# Altium project Stream_Deck.PrjPcb
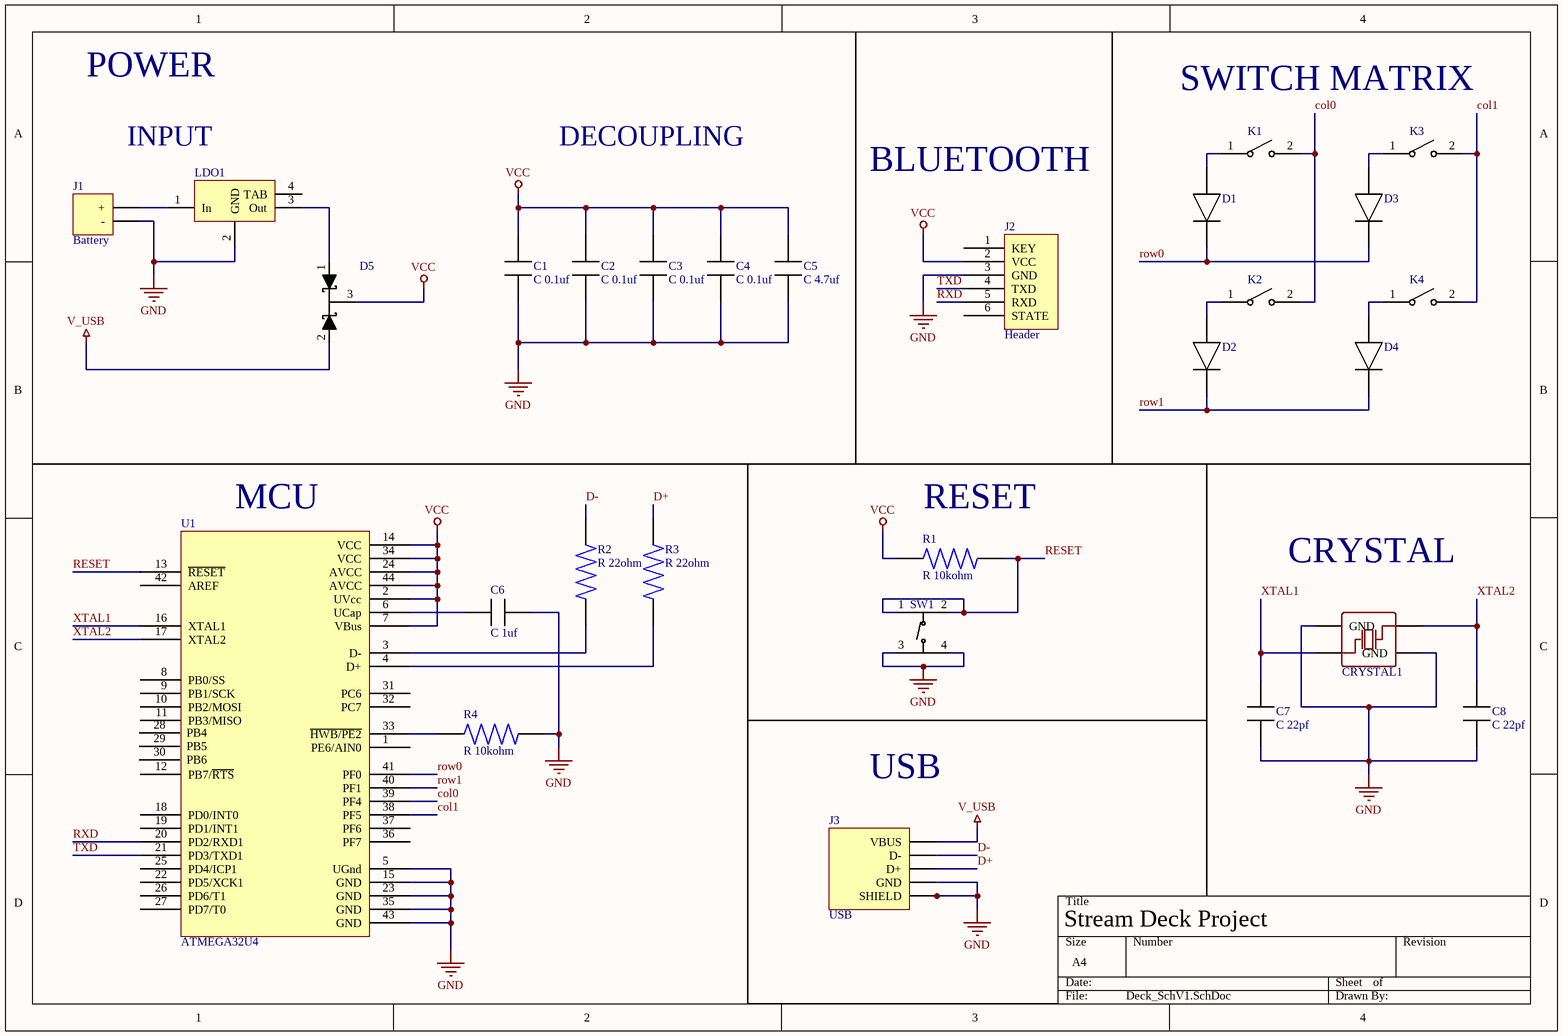
[diagram p0: Deck_SchV1.SchDoc]
1 sheet, 28 parts. Net scope: global (net labels, ports and power ports of the same name join across sheets).
Board file: Deck_PCBV2.PcbDoc

## Sheet Deck_SchV1.SchDoc
size A4; SheetNumber: 1; SheetTotal: 1

### Parts
C1  C 0.1uf  [C0805]
C2  C 0.1uf  [C0805]
C3  C 0.1uf  [C0805]
C4  C 0.1uf  [C0805]
C5  C 4.7uf  [C0805]
C6  C 1uf  [C0805]
C7  C 22pf  [C0805]
C8  C 22pf  [C0805]
CRYSTAL1  Crystal  [CRYSTAL-SMD_4P-L3.2-W2.5-BL]  (value not drawn)
D1  Diode  [Diode]  (value not drawn)
D2  Diode  [Diode]  (value not drawn)
D3  Diode  [Diode]  (value not drawn)
D4  Diode  [Diode]  (value not drawn)
D5  Schottky diode  [SOT95P237X111-3N]  (value not drawn)
J1  Battery  [HDR-TH_2P-P2.54-V-M-1]
J2  Header  [HDR-TH_6P-P2.54-H-W8.6_A2541HWR-6P]
J3  USB  [USB]
K1  Switch  [Mx_Alps_100]  (value not drawn)
K2  Switch  [Mx_Alps_100]  (value not drawn)
K3  Switch  [Mx_Alps_100]  (value not drawn)
K4  Switch  [Mx_Alps_100]  (value not drawn)
LDO1  5V regulator  [SOT-223_L6.5-W3.5-P2.30-LS7.0-BR]  (value not drawn)
R1  R 10kohm  [R0805]
R2  R 22ohm  [R0805]
R3  R 22ohm  [R0805]
R4  R 10kohm  [R0805]
SW1  Button  [SW-SMD_4P-L5.1-W5.1-P3.70-LS6.5-TL-2]  (value not drawn)
U1  ATMEGA32U4  [ATMEGA32U2-AUR]

### Nets
GND: C1.1 C2.1 C3.1 C4.1 C5.1 C6.1 C7.1 C8.1 CRYSTAL1.2(GND) CRYSTAL1.4(GND) J1.2(-) J2.3(GND) J3.4(GND) J3.5(SHIELD) J3.S1 J3.S2 J3.S3 J3.S4 LDO1.2(GND) R4.2 SW1.3(C) SW1.4(D) U1.5(UGnd) U1.15(GND) U1.23(GND) U1.35(GND) U1.43(GND)
V_USB: D5.2 J3.1(VBUS)
VCC: C1.2 C2.2 C3.2 C4.2 C5.2 D5.3 J2.2(VCC) R1.1 U1.2(UVcc) U1.7(VBus) U1.14(VCC) U1.24(AVCC) U1.34(VCC) U1.44(AVCC)
col0: K1.2 K2.2 U1.39(PF4)
col1: K3.2 K4.2 U1.38(PF5)
D+: J3.3(D+) R3.2
D-: J3.2(D-) R2.2
RESET: R1.2 SW1.1(A) SW1.2(B) U1.13(~{RESET})
row0: D1.2(-) D3.2(-) U1.41(PF0)
row1: D2.2(-) D4.2(-) U1.40(PF1)
RXD: J2.5(RXD) U1.20(PD2/RXD1)
TXD: J2.4(TXD) U1.21(PD3/TXD1)
XTAL1: C7.2 CRYSTAL1.1(OSC1) U1.16(XTAL1)
XTAL2: C8.2 CRYSTAL1.3(OSC2) U1.17(XTAL2)
NetC6_2: C6.2 U1.6(UCap)
NetD1_1: D1.1(+) K1.1
NetD2_1: D2.1(+) K2.1
NetD3_1: D3.1(+) K3.1
NetD4_1: D4.1(+) K4.1
NetD5_1: D5.1 LDO1.3(Out)
NetJ1_1: J1.1(+) LDO1.1(In)
NetR2_1: R2.1 U1.3(D-)
NetR3_1: R3.1 U1.4(D+)
NetR4_1: R4.1 U1.33(~{HWB/PE2})

Not connected (* = marked no-connect by the designer): J2 1(KEY) 6(STATE); LDO1 4(TAB); U1 1(PE6/AIN0) 8(PB0/SS) 9(PB1/SCK) 10(PB2/MOSI) 11(PB3/MISO) 12(PB7/~{RTS}) 18(PD0/INT0) 19(PD1/INT1) 22(PD5/XCK1) 25(PD4/ICP1) 26(PD6/T1) 27(PD7/T0) 28(PB4) 29(PB5) 30(PB6) 31(PC6) 32(PC7) 36(PF7) 37(PF6) 42(AREF)

### Notes on the sheet
- POWER
- SWITCH MATRIX
- INPUT
- DECOUPLING
- BLUETOOTH
- (near U1) MCU
- (near R1) RESET
- CRYSTAL
- USB
- Stream Deck Project

### Library data of the parts
C1-C4 = CC0805ZRY5V9BB104: YAGEO (PHYCOMP)         CC0805ZRY5V9BB104             SMD Multilayer Ceramic Capacitor, 0805 [2012 Metric], 0.1 F, 50 V, +80%, -20%, Y5V, CC Series; Capacitance: 100nF; Tolerance: 80%; Voltage Rating: 50V; Supplier 1: Digi-Key; Manufacturer: Yageo; Manufacturer Part Number: CC0805ZRY5V9BB104; RoHS: Yes; Category: Ceramic Capacitors; Stock 1: 165123; Pricing 1: 1=0.10000, 10=0.07000, 50=0.03800, 100=0.03100, 500=0.02214, 1000=0.01739 (USD); Mount: Surface Mount; Case/Package: 0805; Number of Pins: 2; Case Code (Metric): 2012; Case Code (Imperial): 0805; Material: Ceramic; Dielectric Material: Ceramic; Min Operating Temperature: -30°C; Max Operating Temperature: 85°C; Dielectric: Y5V; Package Quantity: 1; Packaging: Tape and Reel; Voltage Rating (DC): 50V; Termination: SMD/SMT; Resistor Type: Ceramic; Series: CC; Construction: Flat; Length: 2mm; Width: 0.049inch; Height: 0.6mm; Depth: 1.25mm; Thickness: 0.024inch; Radiation Hardening: No; REACH SVHC: No SVHC; Lead Free: Lead Free; Halogen Free: Halogen Free; RoHS Compliant: Yes; ComponentLink1URL: https://datasheet.ciiva.com/144/mlccorderingcode-144209.pdf?src-supplier=Digi-Key; ComponentLink1Description: https://datasheet.ciiva.com/144/mlccorderingcode-144209.pdf?src-supplier=Digi-Key; ComponentLink2URL: https://datasheet.ciiva.com/144/mlccorderingcode-144210.pdf?src-supplier=Digi-Key; ComponentLink2Description: https://datasheet.ciiva.com/144/mlccorderingcode-144210.pdf?src-supplier=Digi-Key; ComponentLink3URL: https://datasheet.ciiva.com/144/mlccorderingcode-144211.pdf?src-supplier=Digi-Key; ComponentLink3Description: https://datasheet.ciiva.com/144/mlccorderingcode-144211.pdf?src-supplier=Digi-Key; ComponentLink4URL: https://datasheet.ciiva.com/15189/getdatasheetpartid-55882-15189238.pdf?src-supplier=Verical; ComponentLink4Description: https://datasheet.ciiva.com/15189/getdatasheetpartid-55882-15189238.pdf?src-supplier=Verical; ComponentLink5URL: https://datasheet.ciiva.com/28450/1132289-28450870.pdf?src-supplier=Element14; ComponentLink5Description: https://datasheet.ciiva.com/28450/1132289-28450870.pdf?src-supplier=Element14; ComponentLink6URL: https://datasheet.ciiva.com/13389/upy-gp-np0-16v-to-50v-8-13389351.pdf?src-supplier=Mouser; ComponentLink6Description: https://datasheet.ciiva.com/13389/upy-gp-np0-16v-to-50v-8-13389351.pdf?src-supplier=Mouser; ComponentLink7URL: https://datasheet.ciiva.com/11465/upy-gphc-y5v-6-3v-to-50v-5-11465865.pdf?src-supplier=Avnet; ComponentLink7Description: https://datasheet.ciiva.com/11465/upy-gphc-y5v-6-3v-to-50v-5-11465865.pdf?src-supplier=Avnet; ComponentLink8URL: https://datasheet.ciiva.com/16747/upy-gphc-y5v-6-3v-to-50v-5-revised-16747323.pdf?src-supplier=Future+Electronics; ComponentLink8Description: https://datasheet.ciiva.com/16747/upy-gphc-y5v-6-3v-to-50v-5-revised-16747323.pdf?src-supplier=Future+Electronics; ComponentLink9URL: https://datasheet.ciiva.com/17435/upy-gphc-y5v-6-3v-to-50v-5-17435053.pdf?src-supplier=Avnet+Europe; ComponentLink9Description: https://datasheet.ciiva.com/17435/upy-gphc-y5v-6-3v-to-50v-5-17435053.pdf?src-supplier=Avnet+Europe; ComponentLink10URL: https://datasheet.ciiva.com/29241/445331-da-01-en-kerko-chip-0805-y5v0-1uf-20-80proz50vg-29241946.pdf?src-supplier=Conrad; ComponentLink10Description: https://datasheet.ciiva.com/29241/445331-da-01-en-kerko-chip-0805-y5v0-1uf-20-80proz50vg-29241946.pdf?src-supplier=Conrad; Supplier Part Number 1: 311-1361-1-ND
C5 = CL21A475KAQNNNE: SAMSUNG ELECTRO-MECHANICS - CL21A475KAQNNNE - SMD Multilayer Ceramic Capacitor, 4.7 µF, 25 V, 0805 [2012 Metric], ± 10%, X5R, CL Series; Voltage Rating: 25V; Supplier 1: Digi-Key; Manufacturer: Samsung; Manufacturer Part Number: CL21A475KAQNNNE; RoHS: Yes; Category: Ceramic Capacitors; Pricing 1: 1=0.12000, 10=0.08300, 50=0.04700, 100=0.03890, 500=0.02728, 1000=0.02259 (USD); Mount: Surface Mount; Case/Package: 0805; Case Code (Metric): 2012; Case Code (Imperial): 0805; Min Operating Temperature: -55°C; Max Operating Temperature: 85°C; Package Quantity: 1; Packaging: Tape and Reel; Capacitance: 4.7uF; Tolerance: 10%; Dielectric: X5R; Voltage Rating (DC): 25V; Series: CL; Construction: Flat; Length: 2mm; Width: 0.049inch; Height: 1.25mm; Thickness: 0.055inch; Depth: 1.25mm; Radiation Hardening: No; Lead Free: Lead Free; RoHS Compliant: Yes; ComponentLink1URL: https://datasheet.ciiva.com/25798/cl21a475kaqnnne-25798882.pdf?src-supplier=Digi-Key; ComponentLink1Description: https://datasheet.ciiva.com/25798/cl21a475kaqnnne-25798882.pdf?src-supplier=Digi-Key; Supplier Part Number 1: 1276-1244-1-ND
C6 = CL21B105KBFNNNE: SAMSUNG ELECTRO-MECHANICS - CL21B105KBFNNNE - SMD Multilayer Ceramic Capacitor, 1 µF, 50 V, 0805 [2012 Metric], ± 10%, X7R, CL Series; Voltage Rating: 50V; Supplier 1: Digi-Key; Manufacturer: Samsung; Manufacturer Part Number: CL21B105KBFNNNE; RoHS: Yes; Category: Ceramic Capacitors; Pricing 1: 1=0.13000, 10=0.09000, 50=0.05120, 100=0.04250, 500=0.02978, 1000=0.02465 (USD); Mount: Surface Mount; Case/Package: 0805; Case Code (Metric): 2012; Case Code (Imperial): 0805; Min Operating Temperature: -55°C; Max Operating Temperature: 125°C; Tolerance: 10%; Packaging: Tape and Reel; Package Quantity: 1; Capacitance: 1uF; Dielectric: X7R; Voltage: 50V; Series: CL; Construction: Flat; Length: 2mm; Width: 0.049inch; Height: 1.25mm; Thickness: 0.053inch; Depth: 1.25mm; Radiation Hardening: No; RoHS Compliant: Yes; ComponentLink1URL: https://datasheet.ciiva.com/25800/cl21b105kbfnnne-25800291.pdf?src-supplier=Digi-Key; ComponentLink1Description: https://datasheet.ciiva.com/25800/cl21b105kbfnnne-25800291.pdf?src-supplier=Digi-Key; ComponentLink2URL: https://datasheet.ciiva.com/16449/cl21b105kbfnnne-16449003.pdf?src-supplier=Future+Electronics; ComponentLink2Description: https://datasheet.ciiva.com/16449/cl21b105kbfnnne-16449003.pdf?src-supplier=Future+Electronics; ComponentLink3URL: https://datasheet.ciiva.com/26838/getdatasheetpartid-354075-26838668.pdf?src-supplier=Verical; ComponentLink3Description: https://datasheet.ciiva.com/26838/getdatasheetpartid-354075-26838668.pdf?src-supplier=Verical; Supplier Part Number 1: 1276-1029-1-ND
C7 C8 = CL21C220JBANNNC: Cap Ceramic 22pF 50V C0G 5% SMD 0805 125C T/R; Manufacturer: Samsung; Temperature Coefficient: 300ppm/°C; Supplier 1: Digi-Key; Manufacturer Part Number: CL21C220JBANNNC; RoHS: Yes; Category: Ceramic Capacitors; Stock 1: 3782; Pricing 1: 1=0.10000, 10=0.05400, 50=0.02940, 100=0.02390, 500=0.01710, 1000=0.01344 (USD); Mount: Surface Mount; Case/Package: 0805; Case Code (Metric): 2012; Case Code (Imperial): 0805; Contact Plating: Tin; Material: Ceramic; Min Operating Temperature: -55°C; Max Operating Temperature: 125°C; Tolerance: 5%; Capacitance: 22pF; Dielectric: C0G; Voltage Rating (DC): 50V; Packaging: Tape and Reel; Package Quantity: 1; Voltage Rating: 50V; Voltage: 50V; Length: 2mm; Width: 0.049inch; Height: 0.65mm; Depth: 1.25mm; Thickness: 0.03inch; Radiation Hardening: No; Lead Free: Lead Free; ComponentLink1URL: https://datasheet.ciiva.com/25801/cl21c220jbannnc-25801668.pdf?src-supplier=Digi-Key; ComponentLink1Description: https://datasheet.ciiva.com/25801/cl21c220jbannnc-25801668.pdf?src-supplier=Digi-Key; ComponentLink2URL: https://datasheet.ciiva.com/15227/getdatasheetpartid-355345-15227198.pdf?src-supplier=Verical; ComponentLink2Description: https://datasheet.ciiva.com/15227/getdatasheetpartid-355345-15227198.pdf?src-supplier=Verical; ComponentLink3URL: https://datasheet.ciiva.com/29199/454687-da-01-en-vs-kondensator-0805-29199501.pdf?src-supplier=Conrad; ComponentLink3Description: https://datasheet.ciiva.com/29199/454687-da-01-en-vs-kondensator-0805-29199501.pdf?src-supplier=Conrad; ComponentLink4URL: https://datasheet.ciiva.com/16387/cl05b104kq5nnnc-16387287.pdf?src-supplier=Future+Electronics; ComponentLink4Description: https://datasheet.ciiva.com/16387/cl05b104kq5nnnc-16387287.pdf?src-supplier=Future+Electronics; Supplier Part Number 1: 1276-1047-1-ND
CRYSTAL1 = X1E0000210264: Manufacturer: Seiko; Supplier 1: LCSC; Manufacturer Part Number: X1E0000210264; RoHS: No; Stock 1: 1224; Pricing 1: 1=2.09620, 10=1.67710, 30=1.60010, 100=1.52310, 500=1.48900, 1000=1.47200, 1=2.02540, 10=1.62050, 30=1.54610, 100=1.47170, 500=1.43870, 1000=1.42230, 1=10.59440, 10=8.47640, 30=8.08720, 100=7.69800, 500=7.52550, 1000=7.43980, 1=10.05890, 10=8.04800, 30=7.67840, 100=7.30890, 500=7.14500, 1000=7.06370, 1=1.35280, 10=1.08240, 30=1.03270, 100=0.98300, 500=0.96090, 1000=0.95000, 1=1.17590, 10=0.94090, 30=0.89760, 100=0.85440, 500=0.83530, 1000=0.82580, 1=12.67600, 10=10.14190, 30=9.67620, 100=9.21050, 500=9.00410, 1000=8.90160, 1=176.85110, 10=141.49600, 30=134.99890, 100=128.50180, 500=125.62140, 1000=124.19210, 1=6.69450, 10=5.35620, 30=5.11020, 100=4.86430, 500=4.75520, 1000=4.70110, 1=122.46140, 10=97.97960, 30=93.48070, 100=88.98170, 500=86.98720, 1000=85.99740, 1=13.69750, 10=10.95920, 30=10.45600, 100=9.95270, 500=9.72970, 1000=9.61890, 1=2.16650, 10=1.73340, 30=1.65380, 100=1.57420, 500=1.53890, 1000=1.52140, 1=1.63320, 10=1.30670, 30=1.24670, 100=1.18670, 500=1.16010, 1000=1.14690 (AUD); Supplier Part Number 1: C91744
D1-D4 = 1N4148W-TP: MICRO COMMERCIAL COMPONENTS - 1N4148W-TP - SWITCHING DIODE, 150mA, 100V, SOD123, FU; Manufacturer: MCC; Max Surge Current: 2A; Forward Voltage: 1V; Recovery Time: 4ns; Max Reverse Leakage Current: 5uA; Power Dissipation: 400mW; Max Forward Surge Current (Ifsm): 1A; Element Configuration: Single; Polarity: Standard; Capacitance: 4pF; Supplier 1: Digi-Key; Manufacturer Part Number: 1N4148W-TP; RoHS: Yes; Category: Rectifier Diodes; Stock 1: 2236013; Pricing 1: 1=0.19000, 10=0.17300, 100=0.09440, 500=0.05808, 1000=0.03960 (USD); Mount: Surface Mount; Number of Pins: 2; Min Operating Temperature: -65°C; Max Operating Temperature: 150°C; Packaging: Tape and Reel; Forward Current: 150mA; Package Quantity: 3000; Average Rectified Current: 150mA; Reverse Recovery Time: 4ns; Max Repetitive Reverse Voltage (Vrrm): 100V; Peak Non-Repetitive Surge Current: 2A; Voltage Rating (DC): 100V; Current Rating: 150mA; Output Current: 150mA; Max Reverse Voltage (DC): 100V; Length: 2.85mm; Width: 1.8mm; Height: 1.2mm; Radiation Hardening: No; REACH SVHC: Unknown; Lead Free: Lead Free; ComponentLink1URL: https://datasheet.ciiva.com/1243/1684829-1243908.pdf?src-supplier=Newark; ComponentLink1Description: https://datasheet.ciiva.com/1243/1684829-1243908.pdf?src-supplier=Newark; ComponentLink2URL: https://datasheet.ciiva.com/16836/1n4148wsod123-16836277.pdf?src-supplier=Future+Electronics; ComponentLink2Description: https://datasheet.ciiva.com/16836/1n4148wsod123-16836277.pdf?src-supplier=Future+Electronics; ComponentLink3URL: https://datasheet.ciiva.com/4435/1n4148wsod123-48460-4435223.pdf?src-supplier=Mouser; ComponentLink3Description: https://datasheet.ciiva.com/4435/1n4148wsod123-48460-4435223.pdf?src-supplier=Mouser; ComponentLink4URL: https://datasheet.ciiva.com/14557/70055519-14557767.pdf?src-supplier=Allied+Electronics; ComponentLink4Description: https://datasheet.ciiva.com/14557/70055519-14557767.pdf?src-supplier=Allied+Electronics; ComponentLink5URL: https://datasheet.ciiva.com/911/1n4148wsod123-911676.pdf?src-supplier=Digi-Key; ComponentLink5Description: https://datasheet.ciiva.com/911/1n4148wsod123-911676.pdf?src-supplier=Digi-Key; ComponentLink6URL: https://datasheet.ciiva.com/7622/1684829-7622556.pdf?src-supplier=Element14; ComponentLink6Description: https://datasheet.ciiva.com/7622/1684829-7622556.pdf?src-supplier=Element14; ComponentLink7URL: https://datasheet.ciiva.com/911/1n4148wsod123-911677.pdf?src-supplier=Digi-Key; ComponentLink7Description: https://datasheet.ciiva.com/911/1n4148wsod123-911677.pdf?src-supplier=Digi-Key; ComponentLink8URL: https://datasheet.ciiva.com/911/1n4148wsod123-911678.pdf?src-supplier=Digi-Key; ComponentLink8Description: https://datasheet.ciiva.com/911/1n4148wsod123-911678.pdf?src-supplier=Digi-Key; ComponentLink9URL: https://datasheet.ciiva.com/22747/1684829-22747439.pdf?src-supplier=Element14; ComponentLink9Description: https://datasheet.ciiva.com/22747/1684829-22747439.pdf?src-supplier=Element14; Supplier Part Number 1: 1N4148WTPMSCT-ND
D5 = BAT54CLT1G: Diode Schottky 30V 0.2A 3-Pin SOT-23 T/R; Manufacturer: ON Semiconductor; Forward Current: 200mA; Element Configuration: Common Cathode; Max Power Dissipation: 225mW; Recovery Time: 5ns; Max Reverse Leakage Current: 2uA; Peak Non-Repetitive Surge Current: 600mA; Capacitance: 10pF; Forward Voltage: 800mV; Supplier 1: Digi-Key; Manufacturer Part Number: BAT54CLT1G; RoHS: Yes; Category: Schottky Diodes; Pricing 1: 1=0.17000, 10=0.15600, 100=0.08490, 500=0.05224, 1000=0.03562 (USD); Case/Package: SOT-23-3; Number of Pins: 3; Contact Plating: Tin,Matte; Min Operating Temperature: -55°C; Max Operating Temperature: 125°C; Packaging: Tape and Reel; Package Quantity: 3000; Average Rectified Current: 200mA; Reverse Recovery Time: 5ns; Max Repetitive Reverse Voltage (Vrrm): 30V; Max Forward Surge Current (Ifsm): 600mA; Current Rating: 200mA; Voltage Rating (DC): 30V; Max Reverse Voltage (DC): 30V; Max Surge Current: 600mA; Max Reverse Current: 2uA; Power Dissipation: 225mW; Length: 3.04mm; Width: 1.4mm; Height: 1.01mm; Radiation Hardening: No; Lead Free: Lead Free; Halogen Free: Halogen Free; REACH SVHC: No SVHC; ComponentLink1URL: https://datasheet.ciiva.com/1240/bat54clt1-d-1240707.pdf?src-supplier=Newark; ComponentLink1Description: https://datasheet.ciiva.com/1240/bat54clt1-d-1240707.pdf?src-supplier=Newark; ComponentLink2URL: https://datasheet.ciiva.com/30479/0900766b8121b932-30479128.pdf?src-supplier=RSComponents; ComponentLink2Description: https://datasheet.ciiva.com/30479/0900766b8121b932-30479128.pdf?src-supplier=RSComponents; ComponentLink3URL: https://datasheet.ciiva.com/34301/885769-34301654.pdf?src-supplier=Jameco; ComponentLink3Description: https://datasheet.ciiva.com/34301/885769-34301654.pdf?src-supplier=Jameco; ComponentLink4URL: https://datasheet.ciiva.com/15144/getdatasheetpartid-98336-15144809.pdf?src-supplier=Verical; ComponentLink4Description: https://datasheet.ciiva.com/15144/getdatasheetpartid-98336-15144809.pdf?src-supplier=Verical; ComponentLink5URL: https://datasheet.ciiva.com/1180/bat54clt1-d-1180248.pdf?src-supplier=Element14; ComponentLink5Description: https://datasheet.ciiva.com/1180/bat54clt1-d-1180248.pdf?src-supplier=Element14; ComponentLink6URL: https://datasheet.ciiva.com/1180/bat54clt1-d-1180247.pdf?src-supplier=Element14; ComponentLink6Description: https://datasheet.ciiva.com/1180/bat54clt1-d-1180247.pdf?src-supplier=Element14; ComponentLink7URL: https://datasheet.ciiva.com/22659/1918740-22659014.pdf?src-supplier=Element14; ComponentLink7Description: https://datasheet.ciiva.com/22659/1918740-22659014.pdf?src-supplier=Element14; ComponentLink8URL: https://datasheet.ciiva.com/28655/bat54clt1-d-28655787.pdf?src-supplier=Element14; ComponentLink8Description: https://datasheet.ciiva.com/28655/bat54clt1-d-28655787.pdf?src-supplier=Element14; ComponentLink9URL: https://datasheet.ciiva.com/8294/bat54clt1-d-8294495.pdf?src-supplier=Avnet; ComponentLink9Description: https://datasheet.ciiva.com/8294/bat54clt1-d-8294495.pdf?src-supplier=Avnet; ComponentLink10URL: https://datasheet.ciiva.com/16205/bat54clt1-d-16205033.pdf?src-supplier=Future+Electronics; ComponentLink10Description: https://datasheet.ciiva.com/16205/bat54clt1-d-16205033.pdf?src-supplier=Future+Electronics; ComponentLink11URL: https://datasheet.ciiva.com/905/bat54clt1-d-905835.pdf?src-supplier=Digi-Key; ComponentLink11Description: https://datasheet.ciiva.com/905/bat54clt1-d-905835.pdf?src-supplier=Digi-Key; Supplier Part Number 1: BAT54CLT1GOSCT-ND
J1 = 22-28-4020: CONN HEADER VERT 2POS 2.54MM; Manufacturer: Molex; Number of Contacts: 2; Current Rating: 4A; Voltage Rating: 250V; Gender: Male; Contact Resistance: 20mR; Connector Type: Male Pin; Glow Wire Compliant: Non-compliant; Supplier 1: Digi-Key; Manufacturer Part Number: 22-28-4020; RoHS: Yes; Category: Headers and Wire Housings; Stock 1: 3528; Pricing 1: 1=0.12000, 10=0.08200, 100=0.05890 (USD); Mount: Through Hole; Contact Plating: Tin; Contact Material: Brass,Bronze; Housing Material: Nylon; Color: Black; Housing Color: Black; Min Operating Temperature: 0°C; Max Operating Temperature: 75°C; Number of Rows: 1; Termination: Solder; Orientation: Straight; Package Quantity: 1; Packaging: Bulk; Max Voltage Rating (DC): 250V; Number of Positions: 2; Voltage Rating (DC): 250V; Number of Circuits: 2; Series: KK® 42375; Contact Type: Male Pin; Max Voltage Rating (AC): 250V; Pitch: 2.54mm; Contact Mating Length: 0.24inch; Depth: 2.49mm; Radiation Hardening: No; REACH SVHC: Unknown; Lead Free: Lead Free; Flammability Rating: UL94 V-0; ComponentLink1URL: https://datasheet.ciiva.com/1433/1596842-1433683.pdf?src-supplier=Element14; ComponentLink1Description: https://datasheet.ciiva.com/1433/1596842-1433683.pdf?src-supplier=Element14; ComponentLink2URL: https://datasheet.ciiva.com/30153/214440022284020-pcb-headers-30153261.pdf?src-supplier=Onlinecomponents.com; ComponentLink2Description: https://datasheet.ciiva.com/30153/214440022284020-pcb-headers-30153261.pdf?src-supplier=Onlinecomponents.com; ComponentLink3URL: https://datasheet.ciiva.com/16658/0022284020-pcb-headers-16658182.pdf?src-supplier=Avnet+Europe; ComponentLink3Description: https://datasheet.ciiva.com/16658/0022284020-pcb-headers-16658182.pdf?src-supplier=Avnet+Europe; ComponentLink4URL: https://datasheet.ciiva.com/5157/0022284020-pcb-headers-228358-5157523.pdf?src-supplier=Mouser; ComponentLink4Description: https://datasheet.ciiva.com/5157/0022284020-pcb-headers-228358-5157523.pdf?src-supplier=Mouser; ComponentLink5URL: https://datasheet.ciiva.com/15217/getdatasheetpartid-127875-15217702.pdf?src-supplier=Verical; ComponentLink5Description: https://datasheet.ciiva.com/15217/getdatasheetpartid-127875-15217702.pdf?src-supplier=Verical; ComponentLink6URL: https://datasheet.ciiva.com/10088/0022284020-pcb-headers-10088332.pdf?src-supplier=Avnet; ComponentLink6Description: https://datasheet.ciiva.com/10088/0022284020-pcb-headers-10088332.pdf?src-supplier=Avnet; ComponentLink7URL: https://datasheet.ciiva.com/49385/879406-49385687.pdf?src-supplier=Jameco; ComponentLink7Description: https://datasheet.ciiva.com/49385/879406-49385687.pdf?src-supplier=Jameco; Supplier Part Number 1: WM50014-02-ND
J2 = A2541HWR-6P: Manufacturer: CJT Connectors; Supplier 1: LCSC; Manufacturer Part Number: A2541HWR-6P; Stock 1: 3270; Pricing 1: 1=1.41510, 10=1.13220, 30=1.08030, 100=1.02830, 500=1.00520, 1000=0.99380, 1=1.36720, 10=1.09390, 30=1.04380, 100=0.99360, 500=0.97130, 1000=0.96020, 1=7.15180, 10=5.72210, 30=5.46000, 100=5.19730, 500=5.08050, 1000=5.02280, 1=6.79030, 10=5.43280, 30=5.18400, 100=4.93460, 500=4.82370, 1000=4.76890, 1=0.91320, 10=0.73070, 30=0.69720, 100=0.66370, 500=0.64870, 1000=0.64140, 1=0.79380, 10=0.63510, 30=0.60600, 100=0.57690, 500=0.56390, 1000=0.55750, 1=8.55700, 10=6.84640, 30=6.53280, 100=6.21850, 500=6.07880, 1000=6.00970, 1=119.38420, 10=95.51820, 30=91.14350, 100=86.75790, 500=84.80880, 1000=83.84510, 1=4.51910, 10=3.61570, 30=3.45010, 100=3.28410, 500=3.21030, 1000=3.17390, 1=82.66820, 10=66.14210, 30=63.11280, 100=60.07600, 500=58.72630, 1000=58.05890, 1=9.24660, 10=7.39810, 30=7.05930, 100=6.71960, 500=6.56860, 1000=6.49400, 1=1.46250, 10=1.17010, 30=1.11650, 100=1.06280, 500=1.03890, 1000=1.02710, 1=1.10250, 10=0.88210, 30=0.84170, 100=0.80120, 500=0.78320, 1000=0.77430 (AUD); Supplier Part Number 1: C225514
J3 = UX60SC-MB-5S8: Conn Mini USB 2.0 Type B RCP 5 POS 0.8mm Solder RA SMD 5 Terminal 1 Port Embossed T/R; Manufacturer: Hirose; Number of Terminals/Pins: 5; Gender: Receptacle; Connector Type: USB,Receptacle; Current Rating: 1A; Number of Ports: 1; Insulation Resistance: 100MR; Max Voltage Rating (AC): 5V; USB Standard: USB 2.0; Supplier 1: Digi-Key; Manufacturer Part Number: UX60SC-MB-5S8; RoHS: Yes; Category: USB Connectors; Stock 1: 1825; Pricing 1: 1=0.99000, 10=0.86700, 25=0.81600, 50=0.78200, 100=0.74800, 250=0.68000, 500=0.61200 (USD); Mount: Surface Mount,Horizontal,Through Hole; Contact Material: Copper Alloy,Copper; Contact Plating: Gold; Min Operating Temperature: -30°C; Max Operating Temperature: 75°C; Package Quantity: 1000; Packaging: Tape and Reel; Number of Contacts: 5; Termination: Solder; Orientation: Right Angle; Series: UX60S; Number of Rows: 1; Max Current Rating: 1A; Number of Positions: 5; Length: 7.7mm; Pitch: 0.8mm; Depth: 7mm; REACH SVHC: No SVHC; Lead Free: Lead Free; ComponentLink1URL: https://datasheet.ciiva.com/22666/1693469-22666928.pdf?src-supplier=Element14; ComponentLink1Description: https://datasheet.ciiva.com/22666/1693469-22666928.pdf?src-supplier=Element14; ComponentLink2URL: https://datasheet.ciiva.com/15181/getdatasheetpartid-457316-15181367.pdf?src-supplier=Verical; ComponentLink2Description: https://datasheet.ciiva.com/15181/getdatasheetpartid-457316-15181367.pdf?src-supplier=Verical; ComponentLink3URL: https://datasheet.ciiva.com/4598/ed-ux-20140717-4598805.pdf?src-supplier=Mouser; ComponentLink3Description: https://datasheet.ciiva.com/4598/ed-ux-20140717-4598805.pdf?src-supplier=Mouser; Supplier Part Number 1: H11589CT-ND
K1-K4 = Keyboard Switch
LDO1 = AMS1117-5.0: Manufacturer: Advanced Monolithic Systems; Supplier 1: LCSC; Manufacturer Part Number: AMS1117-5.0; RoHS: Yes; Stock 1: 41515; Pricing 1: 1=1.19980, 10=0.91640, 30=0.86440, 100=0.81230, 500=0.78920, 1000=0.77780, 1=1.15930, 10=0.88550, 30=0.83520, 100=0.78490, 500=0.76260, 1000=0.75150, 1=6.06400, 10=4.63160, 30=4.36890, 100=4.10560, 500=3.98880, 1000=3.93110, 1=5.75740, 10=4.39750, 30=4.14810, 100=3.89800, 500=3.78720, 1000=3.73230, 1=0.77430, 10=0.59140, 30=0.55790, 100=0.52430, 500=0.50930, 1000=0.50200, 1=0.67310, 10=0.51410, 30=0.48490, 100=0.45570, 500=0.44270, 1000=0.43630, 1=7.25540, 10=5.54170, 30=5.22730, 100=4.91220, 500=4.77250, 1000=4.70340, 1=101.22480, 10=77.31550, 30=72.92990, 100=68.53360, 500=66.58440, 1000=65.62070, 1=3.83170, 10=2.92670, 30=2.76070, 100=2.59430, 500=2.52050, 1000=2.48400, 1=70.09360, 10=53.53750, 30=50.50070, 100=47.45640, 500=46.10670, 1000=45.43940, 1=7.84010, 10=5.98830, 30=5.64860, 100=5.30810, 500=5.15710, 1000=5.08250, 1=1.24000, 10=0.94710, 30=0.89340, 100=0.83960, 500=0.81570, 1000=0.80390, 1=0.93480, 10=0.71400, 30=0.67350, 100=0.63290, 500=0.61490, 1000=0.60600 (AUD); Case/Package: Module; Supplier Part Number 1: C6187
R1 R4 = 0805W8F1002T5E: Manufacturer: Uniroyal; Supplier 1: LCSC; Manufacturer Part Number: 0805W8F1002T5E; RoHS: Yes; Stock 1: 3620200; Pricing 1: 100=0.01880, 1000=0.01500, 3000=0.01410, 10000=0.01280, 50000=0.01230, 100000=0.01220, 100=0.01820, 1000=0.01450, 3000=0.01360, 10000=0.01240, 50000=0.01190, 100000=0.01180, 100=0.09500, 1000=0.07590, 3000=0.07110, 10000=0.06490, 50000=0.06200, 100000=0.06150, 100=0.09020, 1000=0.07200, 3000=0.06750, 10000=0.06160, 50000=0.05890, 100000=0.05840, 100=0.01210, 1000=0.00970, 3000=0.00910, 10000=0.00830, 50000=0.00790, 100000=0.00790, 100=0.01050, 1000=0.00840, 3000=0.00790, 10000=0.00720, 50000=0.00690, 100000=0.00680, 100=0.11370, 1000=0.09080, 3000=0.08500, 10000=0.07760, 50000=0.07420, 100000=0.07360, 100=1.58590, 1000=1.26640, 3000=1.18660, 10000=1.08270, 50000=1.03480, 100000=1.02680, 100=0.06000, 1000=0.04790, 3000=0.04490, 10000=0.04100, 50000=0.03920, 100000=0.03890, 100=1.09820, 1000=0.87690, 3000=0.82170, 10000=0.74980, 50000=0.71650, 100000=0.71100, 100=0.12280, 1000=0.09810, 3000=0.09190, 10000=0.08390, 50000=0.08010, 100000=0.07950, 100=0.01940, 1000=0.01550, 3000=0.01450, 10000=0.01330, 50000=0.01270, 100000=0.01260, 100=0.01465, 1000=0.01170, 3000=0.01096, 10000=0.01000, 50000=0.00956, 100000=0.00948 (AUD); RoHS Compliant: Yes; Supplier Part Number 1: C17414
R2 R3 = 0805W8F220JT5E: Manufacturer: Uniroyal; Supplier 1: LCSC; Manufacturer Part Number: 0805W8F220JT5E; RoHS: Yes; Supplier Part Number 1: C17561
SW1 = TS-1187A-B-A-B: Manufacturer: XKB Connectivity; Supplier 1: LCSC; Manufacturer Part Number: TS-1187A-B-A-B; Stock 1: 50; Pricing 1: 50=0.11010, 500=0.08490, 1500=0.07860, 5000=0.07040, 25000=0.06670, 50000=0.06600, 50=0.10630, 500=0.08200, 1500=0.07600, 5000=0.06810, 25000=0.06440, 50000=0.06380, 50=0.55630, 500=0.42910, 1500=0.39730, 5000=0.35600, 25000=0.33690, 50000=0.33380, 50=0.52810, 500=0.40740, 1500=0.37720, 5000=0.33800, 25000=0.31990, 50000=0.31690, 50=0.07100, 500=0.05480, 1500=0.05070, 5000=0.04550, 25000=0.04300, 50000=0.04260, 50=0.06170, 500=0.04760, 1500=0.04410, 5000=0.03950, 25000=0.03740, 50000=0.03700, 50=0.66550, 500=0.51340, 1500=0.47540, 5000=0.42590, 25000=0.40310, 50000=0.39930, 50=9.28540, 500=7.16310, 1500=6.63250, 5000=5.94270, 25000=5.62430, 50000=5.57130, 50=0.35150, 500=0.27110, 1500=0.25110, 5000=0.22500, 25000=0.21290, 50000=0.21090, 50=6.42970, 500=4.96010, 1500=4.59270, 5000=4.11500, 25000=3.89460, 50000=3.85780, 50=0.71920, 500=0.55480, 1500=0.51370, 5000=0.46030, 25000=0.43560, 50000=0.43150, 50=0.11380, 500=0.08780, 1500=0.08130, 5000=0.07280, 25000=0.06890, 50000=0.06830, 50=0.08575, 500=0.06615, 1500=0.06125, 5000=0.05488, 25000=0.05194, 50000=0.05145 (AUD); Supplier Part Number 1: C318884
U1 = ATMEGA32U2-AUR: IC MCU 8BIT 32KB FLASH 32TQFP; Manufacturer: Microchip / Atmel; Number of I/Os: 22; Frequency: 16MHz; Oscillator Type: Internal; Peripherals: Brown-out Detect/Reset,POR,PWM,WDT; Core Architecture: AVR; RAM Size: 1KB; Interface: SPI,USB,UART,USART; Number of Timers/Counters: 2; Max Supply Voltage: 5.5V; Min Supply Voltage: 2.7V; Data Bus Width: 8b; Watchdog Timer: Yes; Supplier 1: Digi-Key; Manufacturer Part Number: ATMEGA32U2-AUR; RoHS: Yes; Category: Microcontrollers; Stock 1: 2741; Pricing 1: 1=3.60000, 25=3.30040, 100=2.97850 (USD); Mount: Surface Mount; Case/Package: TQFP; Number of Pins: 32; Contact Plating: Tin,Matte; Min Operating Temperature: -40°C; Max Operating Temperature: 85°C; Packaging: Tape and Reel; Memory Type: FLASH; Memory Size: 32KB; Series: AVR® ATmega; Package Quantity: 1; Number of Programmable I/O: 22; Max Frequency: 16MHz; RoHS Compliant: Yes; ComponentLink1URL: https://datasheet.ciiva.com/6641/doc7799-6641085.pdf?src-supplier=Digi-Key; ComponentLink1Description: https://datasheet.ciiva.com/6641/doc7799-6641085.pdf?src-supplier=Digi-Key; ComponentLink2URL: https://datasheet.ciiva.com/9234/doc7799-9234685.pdf?src-supplier=Avnet; ComponentLink2Description: https://datasheet.ciiva.com/9234/doc7799-9234685.pdf?src-supplier=Avnet; ComponentLink3URL: https://datasheet.ciiva.com/6641/doc7799-6641080.pdf?src-supplier=Digi-Key; ComponentLink3Description: https://datasheet.ciiva.com/6641/doc7799-6641080.pdf?src-supplier=Digi-Key; ComponentLink4URL: https://datasheet.ciiva.com/6641/doc7799-6641083.pdf?src-supplier=Digi-Key; ComponentLink4Description: https://datasheet.ciiva.com/6641/doc7799-6641083.pdf?src-supplier=Digi-Key; Supplier Part Number 1: ATMEGA32U2-AURCT-ND